# Altium schematic sheet TPS54620.SchDoc
size A
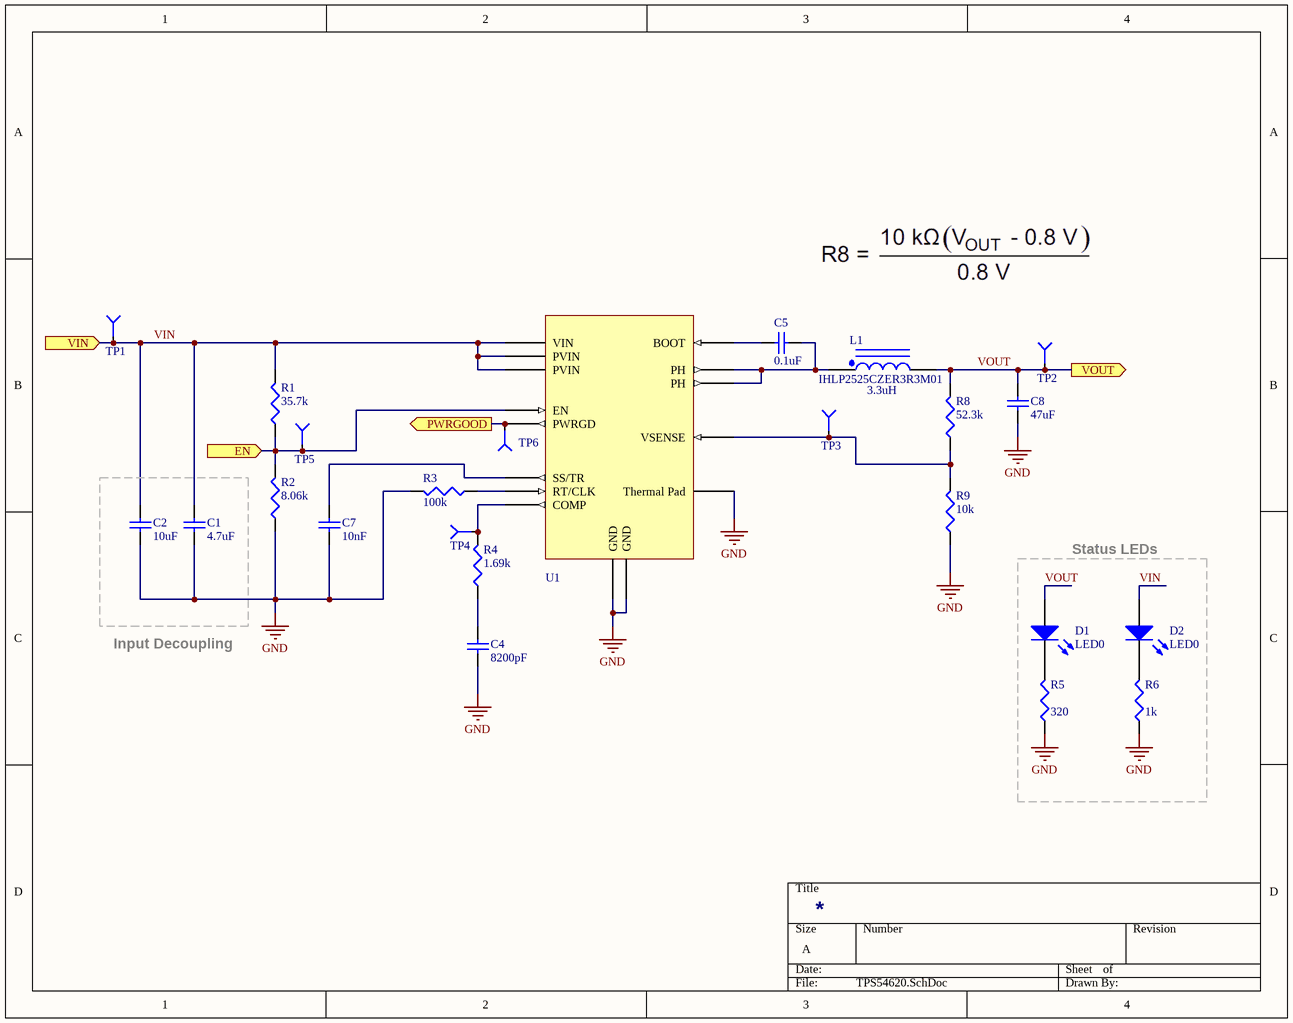
[diagram p0: TPS54620.SchDoc]

## Parts
C1  value 4.7uF  [1608[0603]]  (hidden comment: Cap)
C2  value 10uF  [1608[0603]]  (hidden comment: Cap)
C4  value 8200pF  [1608[0603]]  (hidden comment: Cap)
C5  value 0.1uF  [1608[0603]]  (hidden comment: Cap)
C7  value 10nF  [1608[0603]]  (hidden comment: Cap)
C8  value 47uF  [1608[0603]]  (hidden comment: Cap)
D1  LED0  [0603 LED]
D2  LED0  [0603 LED]
L1  IHLP2525CZER3R3M01  value 3.3uH  [INDP6965X30M]
R1  value 35.7k  [J1-0603]  (hidden comment: Res3)
R2  value 8.06k  [J1-0603]  (hidden comment: Res3)
R3  value 100k  [J1-0603]  (hidden comment: Res3)
R4  value 1.69k  [J1-0603]  (hidden comment: Res3)
R5  value 320  [J1-0603]  (hidden comment: Res3)
R6  value 1k  [J1-0603]  (hidden comment: Res3)
R8  value 52.3k  [J1-0603]  (hidden comment: Res3)
R9  value 10k  [J1-0603]  (hidden comment: Res3)
TP1  Test Point  [TESTPOINT_0.3mm]  (value not drawn)  (no BOM)
TP2  Test Point  [TESTPOINT_0.3mm]  (value not drawn)  (no BOM)
TP3  Test Point  [TESTPOINT_0.3mm]  (value not drawn)  (no BOM)
TP4  Test Point  [TESTPOINT_0.3mm]  (value not drawn)  (no BOM)
TP5  Test Point  [TESTPOINT_0.3mm]  (value not drawn)  (no BOM)
TP6  Test Point  [TESTPOINT_0.3mm]  (value not drawn)  (no BOM)
U1  Buck Regulator  [S-PVQFN-N14]  (value not drawn)

## Blocks framed on the sheet
Status LEDs: D1 D2 R5 R6

## Ports
EN (in), PWRGOOD (out), VIN (in), VOUT (out)

## Nets
GND: C1.2 C2.2 C4.1 C7.1 C8.1 R2.1 R3.2 R5.1 R6.1 R9.1 U1.2(GND) U1.3(GND) U1.PAD(Thermal_Pad)
EN: R1.1 R2.2 TP5.TP U1.10(EN) ; port EN
PWRGOOD: TP6.TP U1.14(PWRGD) ; port PWRGOOD
VIN: C1.1 C2.1 D2.1(A) R1.2 TP1.TP U1.4(PVIN) U1.5(PVIN) U1.6(VIN) ; port VIN
VOUT: C8.2 D1.1(A) L1.2 R8.2 TP2.TP ; port VOUT
NetC4_2: C4.2 R4.1
NetC5_1: C5.1 U1.13(BOOT)
NetC5_2: C5.2 L1.1 U1.11(PH) U1.12(PH)
NetC7_2: C7.2 U1.9(SS/TR)
NetD1_2: D1.2(K) R5.2
NetD2_2: D2.2(K) R6.2
NetR3_1: R3.1 U1.1(RT/CLK)
NetR4_2: R4.2 TP4.TP U1.8(COMP)
NetR8_1: R8.1 R9.2 TP3.TP U1.7(VSENSE)

## Notes on the sheet
- Input Decoupling

## Library data of the parts
C1 C2 C4 C5 C7 C8 = Cap Semi: Capacitor (Semiconductor SIM Model); Published: 8-Jun-2000; LatestRevisionDate: 29-May-2009; LatestRevisionNote: IPC-7351 Footprint Added.; PackageReference: C1206; Publisher: Altium Limited; PackageDescription: Chip Capacitor
D1 D2 = LED0: Typical INFRARED GaAs LED; Published: 8-Jun-2000; LatestRevisionDate: 08-Jul-2005; LatestRevisionNote: Mech Layer 1 removed.; PackageReference: LED-0; Publisher: Altium Limited; PackageDescription: LED; 2 Leads
L1 = IHLP2525CZER3R3M01: 3.3uH Shielded Inductor
R1-R6 R8 R9 = Res3: Resistor; Published: 8-Jun-2000; LatestRevisionDate: 29-May-2009; LatestRevisionNote: IPC-7351 Footprint Added.; PackageReference: J1-0603; Publisher: Altium Limited; PackageDescription: Chip Resistor
U1 = TPS54620RGYT: IC REG BUCK ADJ 6A SYNC 14VQFN; Manufacturer: Texas Instruments; Function: Step-Down; Output Configuration: Positive; Output Type: Adjustable; Number of Outputs: 1; Voltage - Input (Min): 4.5V; Voltage - Input (Max): 17V; Voltage - Output (Min/Fixed): 0.8V; Voltage - Output (Max): 15V; Frequency - Switching: 200kHz ~ 1.6MHz; Synchronous Rectifier: Yes; Supplier 1: Digi-Key; Supplier Part Number 1: 296-24568-1-ND; Manufacturer Part Number: TPS54620RGYT; RoHS: RoHS Compliant; Category: Integrated Circuits (ICs); Stock 1: 2139; Pricing 1: 1=6.52, 10=5.87, 25=5.5, 50=5.35, 100=4.82 (USD); Packaging: Cut Tape (CT); Topology: Buck; Current - Output: 6A; Operating Temperature: -40°C ~ 150°C (TJ); Mounting Type: Surface Mount; Package / Case: 14-VFQFN Exposed Pad; Supplier Device Package: 14-VQFN (3.5x3.5); ComponentLink1URL: http://www.ti.com/lit/ds/symlink/tps54620.pdf; ComponentLink1Description: http://www.ti.com/lit/ds/symlink/tps54620.pdf